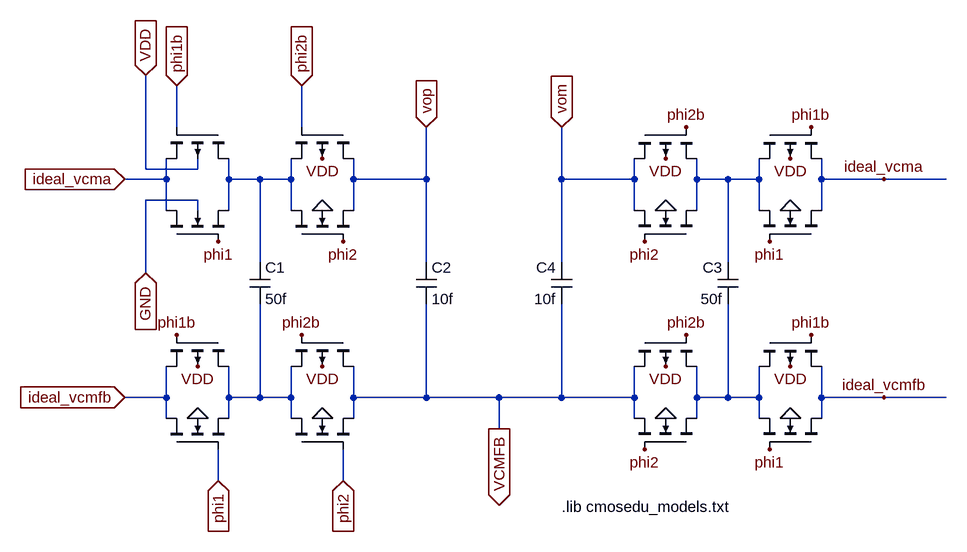
[diagram p0: schematic Fig_26_50.asc]
Fig_26_50.asc, the LTspice schematic file:
Version 4
SHEET 1 1620 680
WIRE 384 -240 384 -384
WIRE 384 -80 384 -192
WIRE 416 -224 352 -224
WIRE 416 -224 416 -256
WIRE 416 -176 416 -224
WIRE 416 112 352 112
WIRE 416 112 416 64
WIRE 416 144 416 112
WIRE 432 -304 432 -368
WIRE 464 -240 384 -240
WIRE 464 -240 464 -256
WIRE 464 -192 384 -192
WIRE 464 -176 464 -192
WIRE 496 240 496 192
WIRE 512 -224 512 -256
WIRE 512 -176 512 -224
WIRE 512 112 512 64
WIRE 512 144 512 112
WIRE 560 -224 512 -224
WIRE 560 -96 560 -224
WIRE 560 112 512 112
WIRE 560 112 560 -32
WIRE 608 -224 560 -224
WIRE 608 -224 608 -256
WIRE 608 -176 608 -224
WIRE 608 112 560 112
WIRE 608 112 608 64
WIRE 608 144 608 112
WIRE 624 -304 624 -368
WIRE 688 240 688 192
WIRE 704 -224 704 -256
WIRE 704 -176 704 -224
WIRE 704 112 704 64
WIRE 704 144 704 112
WIRE 816 -224 704 -224
WIRE 816 -224 816 -304
WIRE 816 -96 816 -224
WIRE 816 112 704 112
WIRE 816 112 816 -32
WIRE 928 112 816 112
WIRE 928 160 928 112
WIRE 1024 -224 1024 -304
WIRE 1024 -96 1024 -224
WIRE 1024 112 928 112
WIRE 1024 112 1024 -32
WIRE 1136 -224 1024 -224
WIRE 1136 -224 1136 -256
WIRE 1136 -176 1136 -224
WIRE 1136 112 1024 112
WIRE 1136 112 1136 64
WIRE 1136 144 1136 112
WIRE 1232 -224 1232 -256
WIRE 1232 -176 1232 -224
WIRE 1232 112 1232 64
WIRE 1232 144 1232 112
WIRE 1280 -224 1232 -224
WIRE 1280 -96 1280 -224
WIRE 1280 112 1232 112
WIRE 1280 112 1280 -32
WIRE 1328 -224 1280 -224
WIRE 1328 -224 1328 -256
WIRE 1328 -176 1328 -224
WIRE 1328 112 1280 112
WIRE 1328 112 1328 64
WIRE 1328 144 1328 112
WIRE 1424 -224 1424 -256
WIRE 1424 -176 1424 -224
WIRE 1424 112 1424 64
WIRE 1424 144 1424 112
WIRE 1520 -224 1424 -224
WIRE 1520 112 1424 112
WIRE 1616 -224 1520 -224
WIRE 1616 112 1520 112
FLAG 496 -128 phi1
FLAG 656 -256 VDD
FLAG 656 -176 0
FLAG 688 -128 phi2
FLAG 464 64 VDD
FLAG 464 144 0
FLAG 432 16 phi1b
FLAG 656 64 VDD
FLAG 656 144 0
FLAG 624 16 phi2b
FLAG 1376 -256 VDD
FLAG 1376 -176 0
FLAG 1344 -128 phi1
FLAG 1408 -304 phi1b
FLAG 1184 -256 VDD
FLAG 1184 -176 0
FLAG 1152 -128 phi2
FLAG 1216 -304 phi2b
FLAG 1376 64 VDD
FLAG 1376 144 0
FLAG 1344 192 phi1
FLAG 1408 16 phi1b
FLAG 1184 64 VDD
FLAG 1184 144 0
FLAG 1152 192 phi2
FLAG 1216 16 phi2b
FLAG 1520 -224 ideal_vcma
FLAG 1520 112 ideal_vcmfb
FLAG 352 -224 ideal_vcma
IOPIN 352 -224 In
FLAG 352 112 ideal_vcmfb
IOPIN 352 112 In
FLAG 384 -384 VDD
IOPIN 384 -384 In
FLAG 384 -80 GND
IOPIN 384 -80 In
FLAG 928 160 VCMFB
IOPIN 928 160 Out
FLAG 816 -304 vop
IOPIN 816 -304 In
FLAG 1024 -304 vom
IOPIN 1024 -304 In
FLAG 432 -368 phi1b
IOPIN 432 -368 In
FLAG 496 240 phi1
IOPIN 496 240 In
FLAG 624 -368 phi2b
IOPIN 624 -368 In
FLAG 688 240 phi2
IOPIN 688 240 In
SYMBOL nmos4 416 -128 R270
WINDOW 0 119 20 Invisible 0
WINDOW 3 157 46 Invisible 0
SYMATTR InstName M1
SYMATTR Value N_50n
SYMATTR Value2 l=50n w=500n
SYMBOL pmos4 512 -304 R90
WINDOW 0 116 21 Invisible 0
WINDOW 3 175 48 Invisible 0
SYMATTR InstName M2
SYMATTR Value P_50n
SYMATTR Value2 l=50n w=500n
SYMBOL nmos4 608 -128 R270
WINDOW 0 119 20 Invisible 0
WINDOW 3 157 46 Invisible 0
SYMATTR InstName M3
SYMATTR Value N_50n
SYMATTR Value2 l=50n w=500n
SYMBOL pmos4 704 -304 R90
WINDOW 0 116 21 Invisible 0
WINDOW 3 175 48 Invisible 0
SYMATTR InstName M4
SYMATTR Value P_50n
SYMATTR Value2 l=50n w=500n
SYMBOL nmos4 416 192 R270
WINDOW 0 119 20 Invisible 0
WINDOW 3 157 46 Invisible 0
SYMATTR InstName M5
SYMATTR Value N_50n
SYMATTR Value2 l=50n w=500n
SYMBOL pmos4 512 16 R90
WINDOW 0 116 21 Invisible 0
WINDOW 3 175 48 Invisible 0
SYMATTR InstName M6
SYMATTR Value P_50n
SYMATTR Value2 l=50n w=500n
SYMBOL nmos4 608 192 R270
WINDOW 0 119 20 Invisible 0
WINDOW 3 157 46 Invisible 0
SYMATTR InstName M7
SYMATTR Value N_50n
SYMATTR Value2 l=50n w=500n
SYMBOL pmos4 704 16 R90
WINDOW 0 116 21 Invisible 0
WINDOW 3 175 48 Invisible 0
SYMATTR InstName M8
SYMATTR Value P_50n
SYMATTR Value2 l=50n w=500n
SYMBOL cap 544 -96 R0
SYMATTR InstName C1
SYMATTR Value 50f
SYMBOL cap 800 -96 R0
SYMATTR InstName C2
SYMATTR Value 10f
SYMBOL nmos4 1424 -128 M270
WINDOW 0 119 20 Invisible 0
WINDOW 3 157 46 Invisible 0
SYMATTR InstName M9
SYMATTR Value N_50n
SYMATTR Value2 l=50n w=500n
SYMBOL pmos4 1328 -304 M90
WINDOW 0 116 21 Invisible 0
WINDOW 3 175 48 Invisible 0
SYMATTR InstName M10
SYMATTR Value P_50n
SYMATTR Value2 l=50n w=500n
SYMBOL nmos4 1232 -128 M270
WINDOW 0 119 20 Invisible 0
WINDOW 3 157 46 Invisible 0
SYMATTR InstName M11
SYMATTR Value N_50n
SYMATTR Value2 l=50n w=500n
SYMBOL pmos4 1136 -304 M90
WINDOW 0 116 21 Invisible 0
WINDOW 3 175 48 Invisible 0
SYMATTR InstName M12
SYMATTR Value P_50n
SYMATTR Value2 l=50n w=500n
SYMBOL nmos4 1424 192 M270
WINDOW 0 119 20 Invisible 0
WINDOW 3 157 46 Invisible 0
SYMATTR InstName M13
SYMATTR Value N_50n
SYMATTR Value2 l=50n w=500n
SYMBOL pmos4 1328 16 M90
WINDOW 0 116 21 Invisible 0
WINDOW 3 175 48 Invisible 0
SYMATTR InstName M14
SYMATTR Value P_50n
SYMATTR Value2 l=50n w=500n
SYMBOL nmos4 1232 192 M270
WINDOW 0 119 20 Invisible 0
WINDOW 3 157 46 Invisible 0
SYMATTR InstName M15
SYMATTR Value N_50n
SYMATTR Value2 l=50n w=500n
SYMBOL pmos4 1136 16 M90
WINDOW 0 116 21 Invisible 0
WINDOW 3 175 48 Invisible 0
SYMATTR InstName M16
SYMATTR Value P_50n
SYMATTR Value2 l=50n w=500n
SYMBOL cap 1296 -96 M0
SYMATTR InstName C3
SYMATTR Value 50f
SYMBOL cap 1040 -96 M0
SYMATTR InstName C4
SYMATTR Value 10f
TEXT 1024 280 Left 0 !.lib cmosedu_models.txt

The netlist it stands for:
* Fig_26_50.asc
M1 ideal_vcma phi1 N001 GND N_50n l=50n w=500n
M2 N001 phi1b ideal_vcma VDD P_50n l=50n w=500n
M3 N001 phi2 vop 0 N_50n l=50n w=500n
M4 vop phi2b N001 VDD P_50n l=50n w=500n
M5 ideal_vcmfb phi1 N002 0 N_50n l=50n w=500n
M6 N002 phi1b ideal_vcmfb VDD P_50n l=50n w=500n
M7 N002 phi2 VCMFB 0 N_50n l=50n w=500n
M8 VCMFB phi2b N002 VDD P_50n l=50n w=500n
C1 N001 N002 50f
C2 vop VCMFB 10f
M9 ideal_vcma phi1 N003 0 N_50n l=50n w=500n
M10 N003 phi1b ideal_vcma VDD P_50n l=50n w=500n
M11 N003 phi2 vom 0 N_50n l=50n w=500n
M12 vom phi2b N003 VDD P_50n l=50n w=500n
M13 ideal_vcmfb phi1 N004 0 N_50n l=50n w=500n
M14 N004 phi1b ideal_vcmfb VDD P_50n l=50n w=500n
M15 N004 phi2 VCMFB 0 N_50n l=50n w=500n
M16 VCMFB phi2b N004 VDD P_50n l=50n w=500n
C3 N003 N004 50f
C4 vom VCMFB 10f
.model NMOS NMOS
.model PMOS PMOS
.lib standard.mos
.lib cmosedu_models.txt
.backanno
.end